# EAGLE schematic FB-UPLpc936 (EAGLE 5.03)
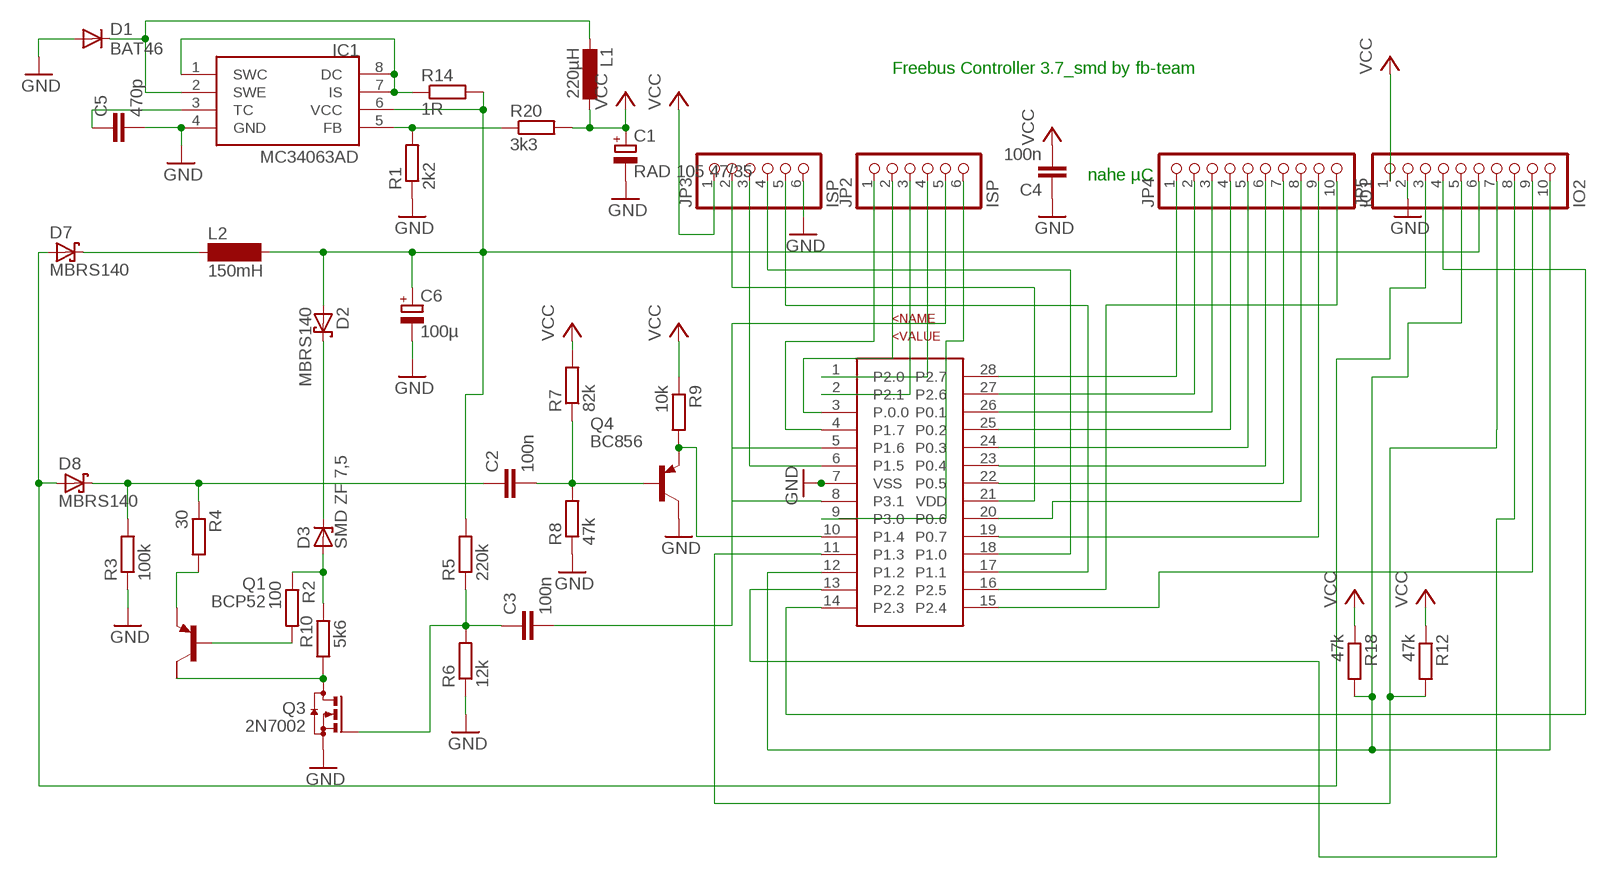
[diagram p0: schematic, sheet 1]

## Parts
C1  RAD 105 47/35  CPOL-EUE2-5  [E2-5]
C2  100n  C-EUC1206  [C1206]
C3  100n  C-EUC1206  [C1206]
C4  100n  C-EUC1206  [C1206]
C5  470p  C-EUC1206  [C1206]
C6  100µ  CPOL-EUE2.5-7  [E2,5-7]
D1  BAT46  DIODE-MINIMELF  [MINIMELF]
D2  MBRS140  MBRS130LT3  [SMB]
D3  SMD ZF 7,5  ZPD  [MINIMELF]
D7  MBRS140  MBRS130LT3  [SMB]
D8  MBRS140  MBRS130LT3  [SMB]
IC1  MC34063AD  [SOIC8]
JP2  ISP  PINHD-1X6  [1X06]
JP3  ISP  PINHD-1X6  [1X06]
JP4  IO1  PINHD-1X10  [1X10]
JP5  IO2  PINHD-1X10  [1X10]
L1  220µH  L-EU2200-11.43  [2200-11.43]
L2  150mH  SD12-1000  [SD12_1000]
Q1  BCP52  FZT753SMD  [SOT223]
Q3  2N7002  BSS123  [SOT23]
Q4  BC856  BC856ALT1SMD  [SOT23-BEC]
R1  2k2  R-EU_R1206  [R1206]
R2  100  R-EU_M1206  [M1206]
R3  100k  R-EU_M1206  [M1206]
R4  30  R-EU_R1206  [R1206]
R5  220k  R-EU_R1206  [R1206]
R6  12k  R-EU_M1206  [M1206]
R7  82k  R-EU_R1206  [R1206]
R8  47k  R-EU_M1206  [M1206]
R9  10k  R-EU_R1206  [R1206]
R10  5k6  R-EU_M1206  [M1206]
R12  47k  R-EU_M1206  [M1206]
R14  1R  R-EU_M1206  [M1206]
R18  47k  R-EU_M1206  [M1206]
R20  3k3  R-EU_M1206  [M1206]
U$1  LPC936TSSOP28  [TSSOP28]

## Nets
GND: C1.- C4.1 C5.2 C6.- D1.A IC1.4(GND) JP3.6 JP5.2 Q3.2(S) Q4.C R1.1 R3.1 R6.1 R8.1 U$1.7(VSS)
N$1: Q4.E R9.2 U$1.10(P1.4)
N$2: C2.2 Q4.B R7.1 R8.2
N$3: IC1.5(FB) R1.2 R20.1
N$4: IC1.1(SWC) IC1.7(IS) IC1.8(DC) R14.1
N$5: C3.2 U$1.5(P1.6)
N$6: Q1.2(C) Q3.3(D) R10.1
N$7: C6.+ D2.A IC1.6(VCC) JP5.6 L2.2 R5.2 R14.2
N$8: D7.C L2.1
N$9: C2.1 D8.C R3.2 R4.1
N$10: D1.C IC1.2(SWE) L1.2
N$11: D3.A R2.1 R10.2
N$12: Q1.3(E) R4.2
N$13: C5.1 IC1.3(TC)
N$14: Q1.1(B) R2.2
N$15: JP2.1 U$1.4(P1.7)
N$16: D7.A D8.A JP5.3
N$17: JP5.4 U$1.14(P2.3)
N$18: JP2.2 U$1.3(P.0.0)
N$19: JP2.3 U$1.2(P2.1)
N$20: JP2.4 U$1.1(P2.0)
N$21: JP4.10 U$1.16(P2.5)
N$22: JP5.9 U$1.15(P2.4)
N$23: JP4.8 U$1.20(P0.6)
N$24: JP5.8 U$1.13(P2.2)
N$25: JP2.5 U$1.8(P3.1)
N$26: JP2.6 U$1.9(P3.0)
N$29: JP3.4 U$1.18(P1.0)
N$30: JP3.5 U$1.17(P1.1)
N$31: JP3.3 U$1.6(P1.5)
N$32: JP3.2 U$1.21(VDD)
N$33: JP5.5 JP5.10 R18.2 U$1.12(P1.2)
N$34: C3.1 Q3.1(G) R5.1 R6.2
N$40: D2.C D3.C
N$42: JP5.7 R12.2 U$1.11(P1.3)
P0.0: JP4.1 U$1.28(P2.7)
P0.1: JP4.2 U$1.27(P2.6)
P0.2: JP4.3 U$1.26(P0.1)
P0.3: JP4.4 U$1.25(P0.2)
P0.4: JP4.5 U$1.24(P0.3)
P0.5: JP4.6 U$1.23(P0.4)
P0.6: JP4.7 U$1.22(P0.5)
P0.7: JP4.9 U$1.19(P0.7)
VCC: C1.+ C4.2 JP3.1 JP5.1 L1.1 R7.2 R9.1 R12.1 R18.1 R20.2
Unconnected: Q1.4(C/)

## Notes on the sheet
- Freebus Controller 3.7_smd by fb-team
- nahe µC

## Library data of the parts
C1 C6 = rcl:CPOL-EU: POLARIZED CAPACITOR, European symbol
C2-C5 = rcl:C-EU: CAPACITOR, European symbol
D1 = diode:DIODE-: DIODE
D2 D7 D8 = diode:MBRS130LT3: Schottky Power Rectifier Source: http://www.onsemi.com/pub/Collateral/MBRS130LT3-D.PDF
D3 = diode:ZPD: Z DIODE 500 mW
IC1 = mc34063:MC34063
JP2 JP3 = pinhead:PINHD-1X6: PIN HEADER
JP4 JP5 = pinhead:PINHD-1X10: PIN HEADER
L1 = rcl:L-EU: INDUCTOR, European symbol
L2 = inductor-neosid:SD12: INDUCTOR nominal inductance
Q1 = transistor-pnp:FZT753SMD: PNP Transistor
Q3 = transistor-small-signal:BSS123: N-CHANNEL MOS FET
Q4 = transistor-pnp:BC856*: PNP Transistror
R1-R10 R12 R14 R18 R20 = rcl:R-EU_: RESISTOR, European symbol
U$1 = freebuslpc:LPC936: C51 Based Microcontroller LPC936 ADC and 16kbyte Flash